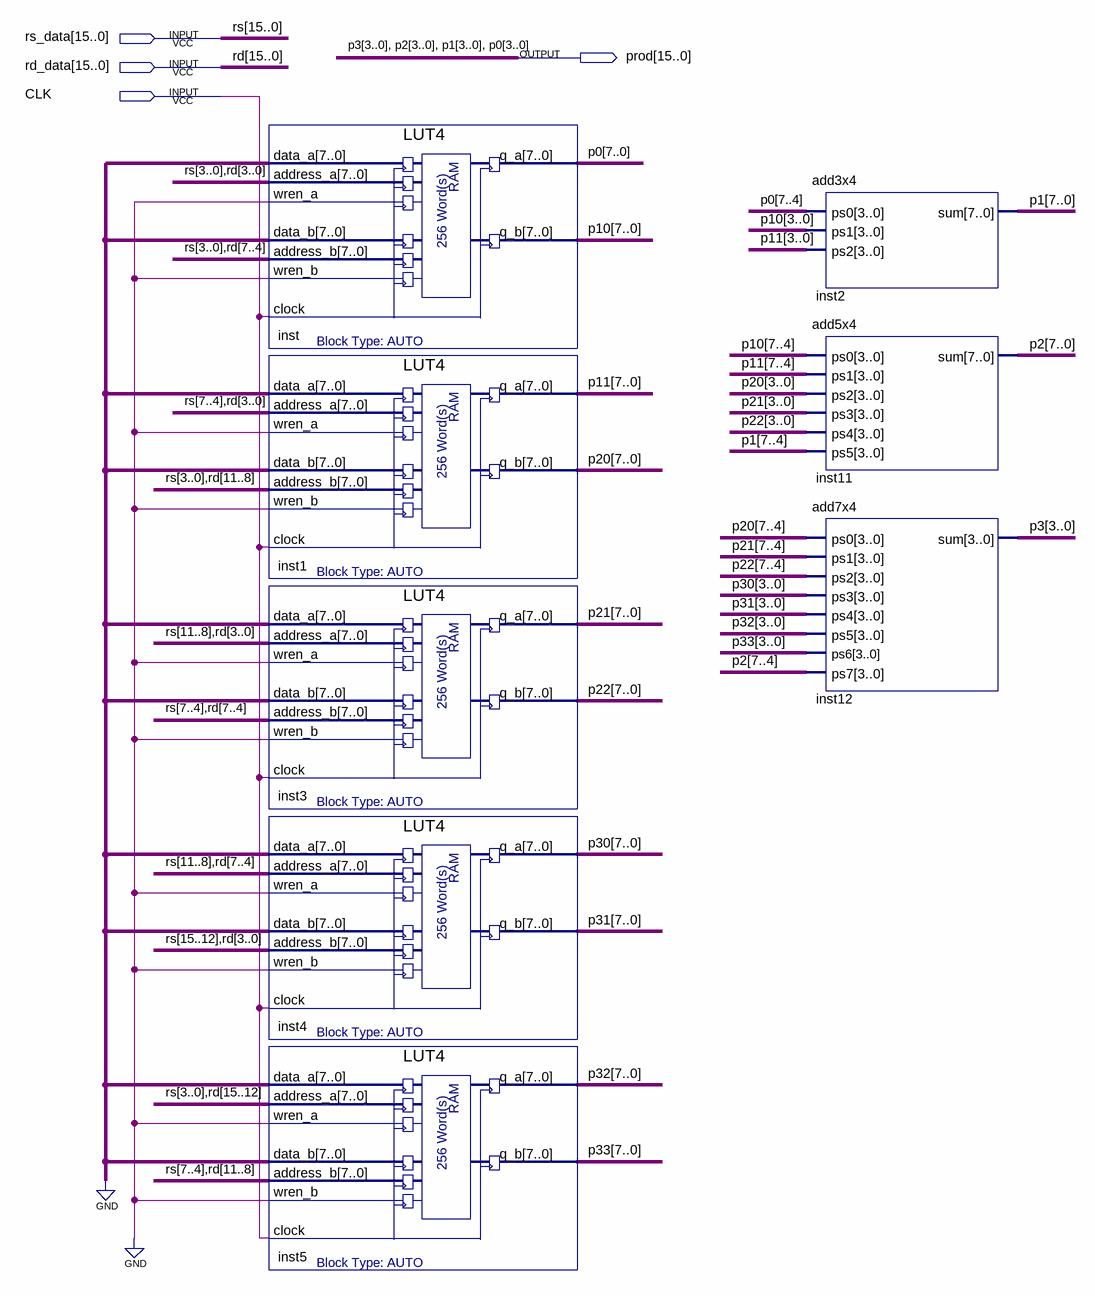
[diagram p0: schematic sheet]
// Quartus schematic improved_mult.bdf as structural Verilog: 8 symbols, 4 pins
module improved_mult (
  input  [15:0] rs_data,
  input  [15:0] rd_data,
  input  CLK,
  output [15:0] prod
);

  wire [7:0] p10, p11, p20, p21, p22, p30, p31, p32, p33;
  wire [7:4] p0, p1, p2;

  LUT4 inst (
    .data_a({8{1'b0}}), .address_a({rs_data[3:0], rd_data[3:0]}), .wren_a(1'b0), .data_b({8{1'b0}}),
    .address_b({rs_data[3:0], rd_data[7:4]}), .wren_b(1'b0), .clock(CLK), .q_a({p0, prod[3:0]}), .q_b(p10));
  LUT4 inst1 (
    .data_a({8{1'b0}}), .address_a({rs_data[7:4], rd_data[3:0]}), .wren_a(1'b0), .data_b({8{1'b0}}),
    .address_b({rs_data[3:0], rd_data[11:8]}), .wren_b(1'b0), .clock(CLK), .q_a(p11), .q_b(p20));
  LUT4 inst3 (
    .data_a({8{1'b0}}), .address_a({rs_data[11:8], rd_data[3:0]}), .wren_a(1'b0), .data_b({8{1'b0}}),
    .address_b({rs_data[7:4], rd_data[7:4]}), .wren_b(1'b0), .clock(CLK), .q_a(p21), .q_b(p22));
  LUT4 inst4 (
    .data_a({8{1'b0}}), .address_a({rs_data[11:8], rd_data[7:4]}), .wren_a(1'b0), .data_b({8{1'b0}}),
    .address_b({rs_data[15:12], rd_data[3:0]}), .wren_b(1'b0), .clock(CLK), .q_a(p30), .q_b(p31));
  LUT4 inst5 (
    .data_a({8{1'b0}}), .address_a({rs_data[3:0], rd_data[15:12]}), .wren_a(1'b0), .data_b({8{1'b0}}),
    .address_b({rs_data[7:4], rd_data[11:8]}), .wren_b(1'b0), .clock(CLK), .q_a(p32), .q_b(p33));
  add3x4 inst2 (.ps0(p0), .ps1(p10[3:0]), .ps2(p11[3:0]), .sum({p1, prod[7:4]}));
  add5x4 inst11 (
    .ps0(p10[7:4]), .ps1(p11[7:4]), .ps2(p20[3:0]), .ps3(p21[3:0]), .ps4(p22[3:0]), .ps5(p1),
    .sum({p2, prod[11:8]}));
  add7x4 inst12 (
    .ps0(p20[7:4]), .ps1(p21[7:4]), .ps2(p22[7:4]), .ps3(p30[3:0]), .ps4(p31[3:0]), .ps5(p32[3:0]),
    .ps6(p33[3:0]), .ps7(p2), .sum(prod[15:12]));

  // Other names for the same wires on the sheet: p0[3:0] = prod[3:0]; p1[3:0] = prod[7:4]; p2[3:0] = prod[11:8];
  //   p3[3:0] = prod[15:12]; rd[15:0] = rd_data; rs[15:0] = rs_data
endmodule
